# EAGLE design Car (EAGLE 7.3.0)
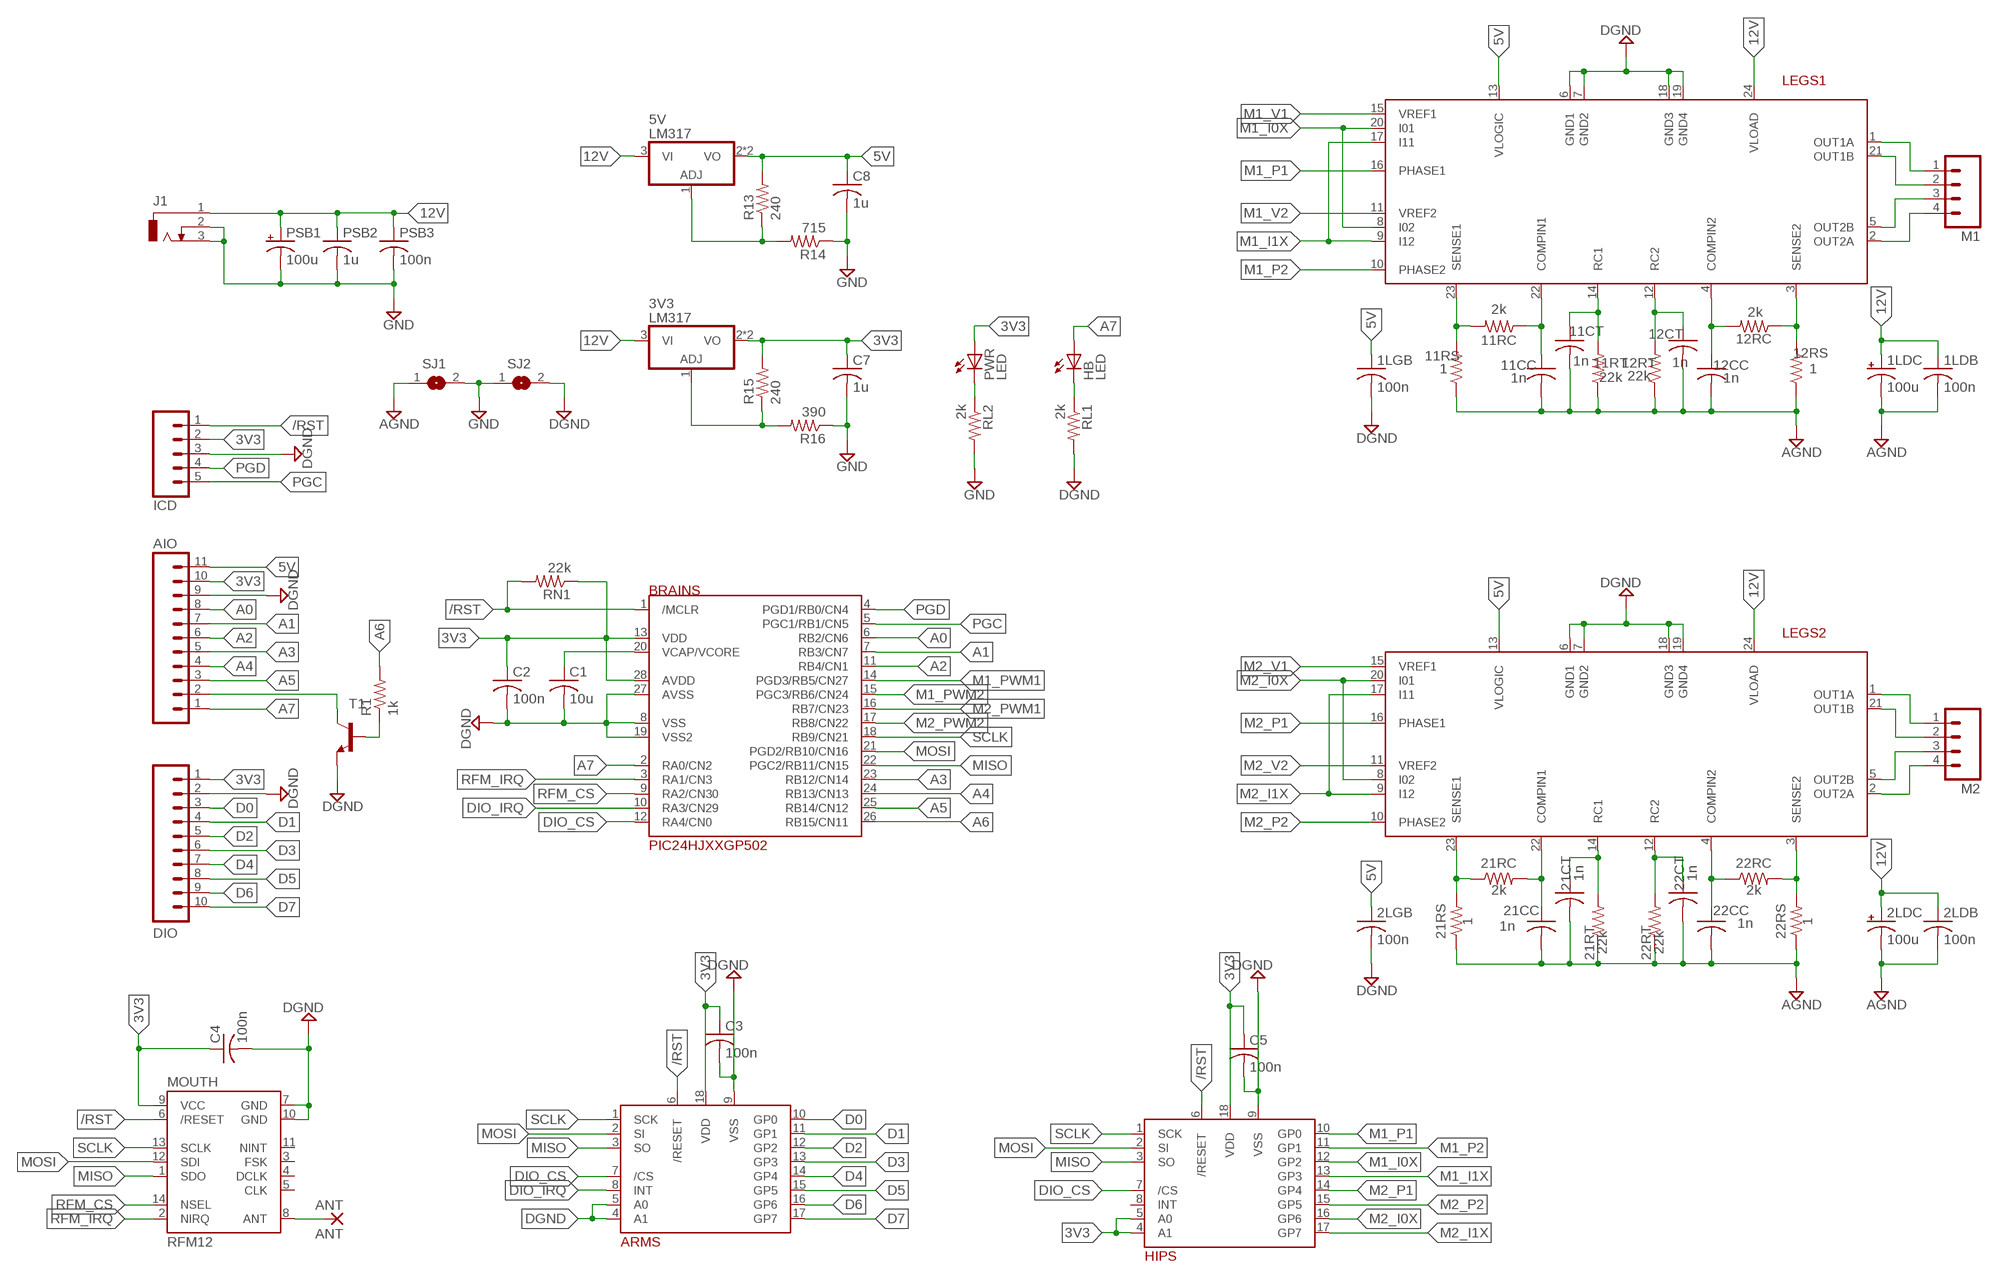
[diagram p0: schematic, sheet 1, part 1 of 2]
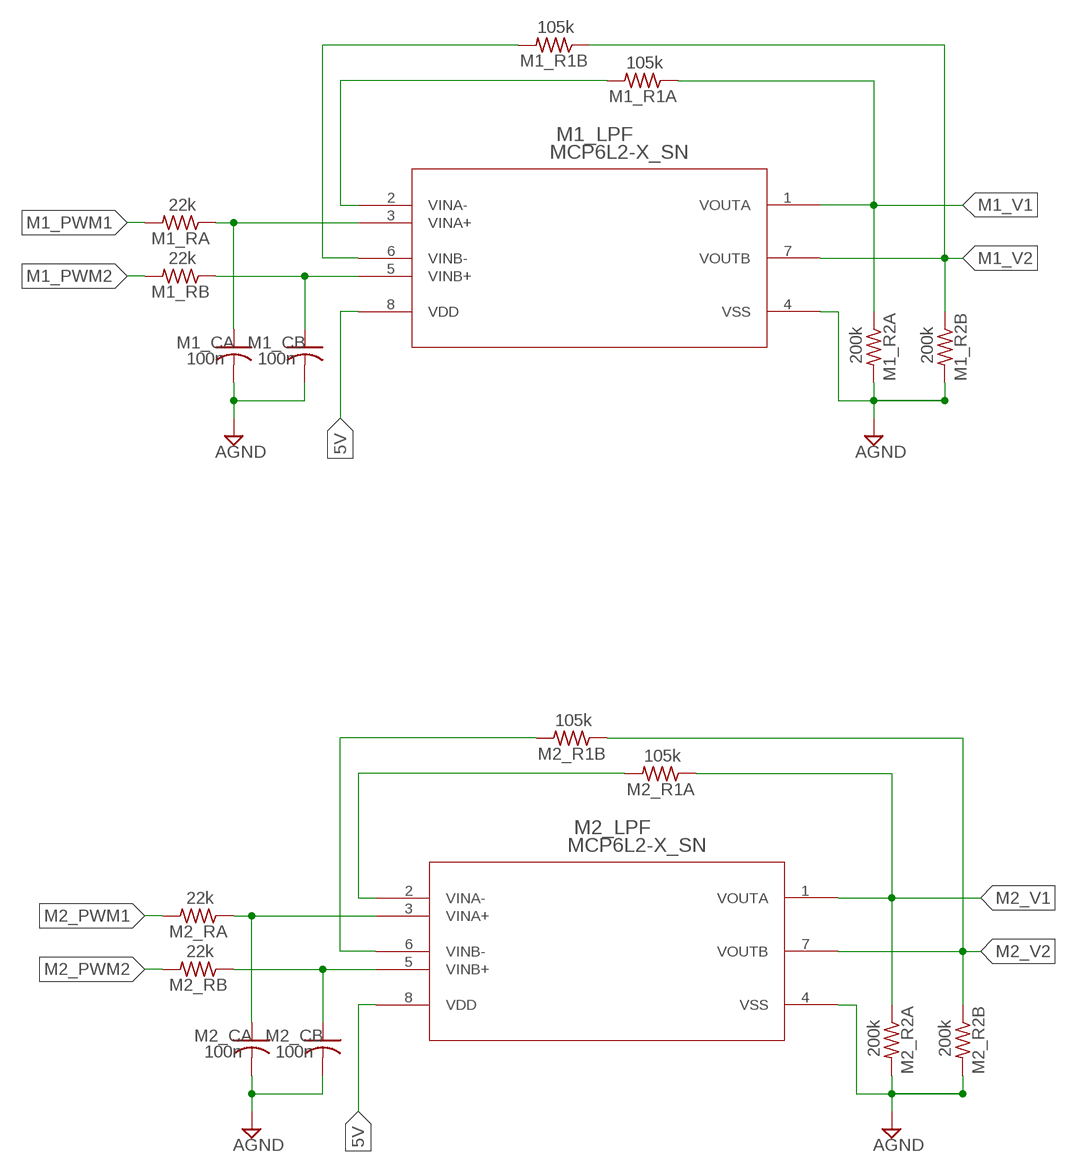
[diagram p1: schematic, sheet 1, part 2 of 2]

## Parts
1LDB  100n  C-USC0805  [C0805]
1LDC  100u  CAP_POLC  [PANASONIC_C]
1LGB  100n  C-USC0805  [C0805]
2LDB  100n  C-USC0805  [C0805]
2LDC  100u  CAP_POLC  [PANASONIC_C]
2LGB  100n  C-USC0805  [C0805]
3V3  LM317  [SOT23]
5V  LM317  [SOT23]
11CC  1n  C-USC0805  [C0805]
11CT  1n  C-USC0805  [C0805]
11RC  2k  R-US_R0805  [R0805]
11RS  1  R-US_R2512  [R2512]
11RT  22k  R-US_R0805  [R0805]
12CC  1n  C-USC0805  [C0805]
12CT  1n  C-USC0805  [C0805]
12RC  2k  R-US_R0805  [R0805]
12RS  1  R-US_R2512  [R2512]
12RT  22k  R-US_R0805  [R0805]
21CC  1n  C-USC0805  [C0805]
21CT  1n  C-USC0805  [C0805]
21RC  2k  R-US_R0805  [R0805]
21RS  1  R-US_R2512  [R2512]
21RT  22k  R-US_R0805  [R0805]
22CC  1n  C-USC0805  [C0805]
22CT  1n  C-USC0805  [C0805]
22RC  2k  R-US_R0805  [R0805]
22RS  1  R-US_R2512  [R2512]
22RT  22k  R-US_R0805  [R0805]
AIO  M11LOCK  [1X11_LOCK]
ANT  ANT  2,15/1,0  [2,15/1,0]
ARMS  MCP23S08  [SO-18W]
BRAINS  PIC24HJXXGP502  [SO28W]
C1  10u  C-USC1206  [C1206]
C2  100n  C-USC0805  [C0805]
C3  100n  C-USC0805  [C0805]
C4  100n  C-USC0805  [C0805]
C5  100n  C-USC0805  [C0805]
C7  1u  C-USC1206  [C1206]
C8  1u  C-USC1206  [C1206]
DIO  M10LOCK  [1X10_LOCK]
HB  LED  LEDCHIP-LED0805  [CHIP-LED0805]
HIPS  MCP23S08  [SO-18W]
ICD  M05LOCK  [1X05_LOCK]
J1  DCJ0303  [DCJ0303]
LEGS1  MTS62C19A  [SOP24L]
LEGS2  MTS62C19A  [SOP24L]
M1  M04LOCK_LONGPADS  [1X04_LOCK_LONGPADS]
M1_CA  100n  C-USC0805  [C0805]
M1_CB  100n  C-USC0805  [C0805]
M1_LPF  MCP6L2-X_SN  [SOIC8-N_MC]
M1_R1A  105k  R-US_R0805  [R0805]
M1_R1B  105k  R-US_R0805  [R0805]
M1_R2A  200k  R-US_R0805  [R0805]
M1_R2B  200k  R-US_R0805  [R0805]
M1_RA  22k  R-US_R0805  [R0805]
M1_RB  22k  R-US_R0805  [R0805]
M2  M04LOCK_LONGPADS  [1X04_LOCK_LONGPADS]
M2_CA  100n  C-USC0805  [C0805]
M2_CB  100n  C-USC0805  [C0805]
M2_LPF  MCP6L2-X_SN  [SOIC8-N_MC]
M2_R1A  105k  R-US_R0805  [R0805]
M2_R1B  105k  R-US_R0805  [R0805]
M2_R2A  200k  R-US_R0805  [R0805]
M2_R2B  200k  R-US_R0805  [R0805]
M2_RA  22k  R-US_R0805  [R0805]
M2_RB  22k  R-US_R0805  [R0805]
MOUTH  RFM12  [RFM12-XXX-S2]
PSB1  100u  CAP_POLC  [PANASONIC_C]
PSB2  1u  C-USC1206  [C1206]
PSB3  100n  C-USC0805  [C0805]
PWR  LED  LEDCHIP-LED0805  [CHIP-LED0805]
R1  1k  R-US_R0805  [R0805]
R13  240  R-US_R0805  [R0805]
R14  715  R-US_R0805  [R0805]
R15  240  R-US_R0805  [R0805]
R16  390  R-US_R0805  [R0805]
RL1  2k  R-US_R0805  [R0805]
RL2  2k  R-US_R0805  [R0805]
RN1  22k  R-US_R0805  [R0805]
SJ1  SJ  [SJ]
SJ2  SJ  [SJ]
T1  BC817-16-NPN-SOT23-BEC  [SOT23-BEC]

## Nets
3V3 [power]: 3V3.2(VO) 3V3.4(VO) AIO.10 ARMS.18(VDD) BRAINS.13(VDD) BRAINS.28(AVDD) C2.1 C3.1 C4.1 C5.1 C7.1 DIO.1 HIPS.4(A1) HIPS.5(A0) HIPS.18(VDD) ICD.2 MOUTH.9(VCC) PWR.A R15.2 RN1.1
5V [power]: 1LGB.1 2LGB.1 5V.2(VO) 5V.4(VO) AIO.11 C8.1 LEGS1.13(VLOGIC) LEGS2.13(VLOGIC) M1_LPF.8(VDD) M2_LPF.8(VDD) R13.2
12V [power]: 1LDB.1 1LDC.+ 2LDB.1 2LDC.+ 3V3.3(VI) 5V.3(VI) J1.1 LEGS1.24(VLOAD) LEGS2.24(VLOAD) PSB1.+ PSB2.1 PSB3.1
/RST: ARMS.6(/RESET) BRAINS.1(/MCLR) HIPS.6(/RESET) ICD.1 MOUTH.6(/RESET) RN1.2
A0: AIO.8 BRAINS.6(RB2/CN6)
A1: AIO.7 BRAINS.7(RB3/CN7)
A2: AIO.6 BRAINS.11(RB4/CN1)
A3: AIO.5 BRAINS.23(RB12/CN14)
A4: AIO.4 BRAINS.24(RB13/CN13)
A5: AIO.3 BRAINS.25(RB14/CN12)
A6: BRAINS.26(RB15/CN11) R1.2
A7: AIO.1 BRAINS.2(RA0/CN2) HB.A
AGND [power]: 1LDB.2 1LDC.- 2LDB.2 2LDC.- 11CC.2 11CT.2 11RS.1 11RT.1 12CC.2 12CT.2 12RS.1 12RT.1 21CC.2 21CT.2 21RS.1 21RT.1 22CC.2 22CT.2 22RS.1 22RT.1 M1_CA.2 M1_CB.2 M1_LPF.4(VSS) M1_R2A.2 M1_R2B.2 M2_CA.2 M2_CB.2 M2_LPF.4(VSS) M2_R2A.2 M2_R2B.2 SJ1.1
D0: ARMS.10(GP0) DIO.3
D1: ARMS.11(GP1) DIO.4
D2: ARMS.12(GP2) DIO.5
D3: ARMS.13(GP3) DIO.6
D4: ARMS.14(GP4) DIO.7
D5: ARMS.15(GP5) DIO.8
D6: ARMS.16(GP6) DIO.9
D7: ARMS.17(GP7) DIO.10
DGND [power]: 1LGB.2 2LGB.2 AIO.9 ARMS.4(A1) ARMS.5(A0) ARMS.9(VSS) BRAINS.8(VSS) BRAINS.19(VSS2) BRAINS.27(AVSS) C1.2 C2.2 C3.2 C4.2 C5.2 DIO.2 HIPS.9(VSS) ICD.3 LEGS1.6(GND1) LEGS1.7(GND2) LEGS1.18(GND3) LEGS1.19(GND4) LEGS2.6(GND1) LEGS2.7(GND2) LEGS2.18(GND3) LEGS2.19(GND4) MOUTH.7(GND) MOUTH.10(GND) RL1.2 SJ2.2 T1.E
DIO_CS: ARMS.7(/CS) BRAINS.12(RA4/CN0) HIPS.7(/CS)
DIO_IRQ: ARMS.8(INT) BRAINS.10(RA3/CN29)
GND [power]: C7.2 C8.2 J1.2 J1.3 PSB1.- PSB2.2 PSB3.2 R14.1 R16.1 RL2.2 SJ1.2 SJ2.1
M1_I0X [power]: HIPS.12(GP2) LEGS1.8(I02) LEGS1.20(I01)
M1_I1X [power]: HIPS.13(GP3) LEGS1.9(I12) LEGS1.17(I11)
M1_P1: HIPS.10(GP0) LEGS1.16(PHASE1)
M1_P2: HIPS.11(GP1) LEGS1.10(PHASE2)
M1_PWM1: BRAINS.14(PGD3/RB5/CN27) M1_RA.2
M1_PWM2: BRAINS.15(PGC3/RB6/CN24) M1_RB.2
M1_V1: LEGS1.15(VREF1) M1_LPF.1(VOUTA) M1_R1A.1 M1_R2A.1
M1_V2: LEGS1.11(VREF2) M1_LPF.7(VOUTB) M1_R1B.1 M1_R2B.1
M2_I0X [power]: HIPS.16(GP6) LEGS2.8(I02) LEGS2.20(I01)
M2_I1X [power]: HIPS.17(GP7) LEGS2.9(I12) LEGS2.17(I11)
M2_P1: HIPS.14(GP4) LEGS2.16(PHASE1)
M2_P2: HIPS.15(GP5) LEGS2.10(PHASE2)
M2_PWM1: BRAINS.16(RB7/CN23) M2_RA.2
M2_PWM2: BRAINS.17(RB8/CN22) M2_RB.2
M2_V1: LEGS2.15(VREF1) M2_LPF.1(VOUTA) M2_R1A.1 M2_R2A.1
M2_V2: LEGS2.11(VREF2) M2_LPF.7(VOUTB) M2_R1B.1 M2_R2B.1
MISO: ARMS.3(SO) BRAINS.22(PGC2/RB11/CN15) HIPS.3(SO) MOUTH.1(SDO)
MOSI: ARMS.2(SI) BRAINS.21(PGD2/RB10/CN16) HIPS.2(SI) MOUTH.12(SDI)
N$1 [power]: LEGS1.21(OUT1B) M1.2
N$2 [power]: LEGS1.1(OUT1A) M1.1
N$3: M1_CA.1 M1_LPF.3(VINA+) M1_RA.1
N$4 [power]: LEGS1.5(OUT2B) M1.3
N$5 [power]: LEGS1.2(OUT2A) M1.4
N$6 [power]: LEGS2.21(OUT1B) M2.2
N$7: M1_LPF.2(VINA-) M1_R1A.2
N$8 [power]: LEGS2.1(OUT1A) M2.1
N$9 [power]: LEGS2.5(OUT2B) M2.3
N$10 [power]: LEGS2.2(OUT2A) M2.4
N$11: ANT.1(P) MOUTH.8(ANT)
N$12: M2_CA.1 M2_LPF.3(VINA+) M2_RA.1
N$13 [power]: 21RC.1 21RS.2 LEGS2.23(SENSE1)
N$14: 21CC.1 21RC.2 LEGS2.22(COMPIN1)
N$15: 22CT.1 22RT.2 LEGS2.12(RC2)
N$16 [power]: 22RC.2 22RS.2 LEGS2.3(SENSE2)
N$17: 22CC.1 22RC.1 LEGS2.4(COMPIN2)
N$18: 21CT.1 21RT.2 LEGS2.14(RC1)
N$19: M2_LPF.2(VINA-) M2_R1A.2
N$20: 3V3.1(ADJ) R15.1 R16.2
N$21: M1_LPF.6(VINB-) M1_R1B.2
N$22: M1_CB.1 M1_LPF.5(VINB+) M1_RB.1
N$23: M2_LPF.6(VINB-) M2_R1B.2
N$24: M2_CB.1 M2_LPF.5(VINB+) M2_RB.1
N$26: AIO.2 T1.C
N$27: 5V.1(ADJ) R13.1 R14.2
N$28: R1.1 T1.B
N$31 [power]: 11RC.2 11RS.2 LEGS1.23(SENSE1)
N$33: 11CC.1 11RC.1 LEGS1.22(COMPIN1)
N$34: 12CC.1 12RC.2 LEGS1.4(COMPIN2)
N$35 [power]: 12RC.1 12RS.2 LEGS1.3(SENSE2)
N$40: BRAINS.20(VCAP/VCORE) C1.1
N$41: 11CT.1 11RT.2 LEGS1.14(RC1)
N$42: 12CT.1 12RT.2 LEGS1.12(RC2)
N$46: HB.C RL1.1
N$65: PWR.C RL2.1
PGC: BRAINS.5(PGC1/RB1/CN5) ICD.5
PGD: BRAINS.4(PGD1/RB0/CN4) ICD.4
RFM_CS: BRAINS.9(RA2/CN30) MOUTH.14(NSEL)
RFM_IRQ: BRAINS.3(RA1/CN3) MOUTH.2(NIRQ)
SCLK: ARMS.1(SCK) BRAINS.18(RB9/CN21) HIPS.1(SCK) MOUTH.13(SCLK)
Unconnected: HIPS.8(INT) MOUTH.3(FSK) MOUTH.4(DCLK) MOUTH.5(CLK) MOUTH.11(NINT)

## Library data of the parts
1LDB 1LGB 2LDB 2LGB 11CC 11CT 12CC 12CT 21CC 21CT 22CC 22CT C1-C5 C7 C8 M1_CA M1_CB M2_CA M2_CB PSB2 PSB3 = rcl:C-US: CAPACITOR, American symbol
1LDC 2LDC PSB1 = SparkFun-Passives:CAP_POL: Capacitor Polarized These are standard SMD and PTH capacitors. Normally 10uF, 47uF, and 100uF in electrolytic and tantalum varieties. Always verify the external diameter of the through hole cap, it varies with capacity, voltage, and manufacturer. The EIA devices should be standard.
3V3 5V = misc:LM317
11RC 11RT 12RC 12RT 21RC 21RT 22RC 22RT M1_R1A M1_R1B M1_R2A M1_R2B M1_RA M1_RB M2_R1A M2_R1B M2_R2A M2_R2B M2_RA M2_RB R1 R13-R16 RL1 RL2 RN1 = rcl:R-US_: RESISTOR, American symbol
11RS 12RS 21RS 22RS = resistor:R-US_: RESISTOR, American symbol
AIO = SparkFun-Connectors:M11: Header 11 Standard 11-pin 0.1" header. Use with straight break away headers (SKU : PRT-00116), right angle break away headers (PRT-00553), swiss pins (PRT-00743), machine pins (PRT-00117), and female headers (PRT-00115).
ANT = wirepad:2,15/1,0: THROUGH-HOLE PAD
ARMS HIPS = microchip:MCP23S08
BRAINS = microchip:PIC24HJXXGP502
DIO = SparkFun-Connectors:M10: Header 10 Standard 10-pin 0.1" header. Use with straight break away headers (SKU : PRT-00116), right angle break away headers (PRT-00553), swiss pins (PRT-00743), machine pins (PRT-00117), and female headers (PRT-00115).
HB PWR = led:LED: LED OSRAM: - CHIPLED LG R971, LG N971, LY N971, LG Q971, LY Q971, LO R971, LY R971 LH N974, LH R974 LS Q976, LO Q976, LY Q976 LO Q996 - Hyper CHIPLED LW Q18S LB Q993, LB Q99A, LB R99A - SideLED LS A670, LO A670, LY A670, LG A670, LP A670 LB A673, LV A673, LT A673, LW A673 LH A674 LY A675 LS A676, LA A676, LO A676, LY A676, LW A676 LS A679, LY A679, LG A679 - Hyper Micro SIDELED® LS Y876, LA Y876, LO Y876, LY Y876 LT Y87S - SmartLED LW L88C, LW L88S LB L89C, LB L89S, LG L890 LS L89K, LO L89K, LY L89K LS L896, LA L896, LO L896, LY L896 - TOPLED LS T670, LO T670, LY T670, LG T670, LP T670 LSG T670, LSP T670, LSY T670, LOP T670, LYG T670 LG T671, LOG T671, LSG T671 LB T673, LV T673, LT T673, LW T673 LH T674 LS T676, LA T676, LO T676, LY T676, LB T676, LH T676, LSB T676, LW T676 LB T67C, LV T67C, LT T67C, LS T67K, LO T67K, LY T67K, LW E67C LS E67B, LA E67B, LO E67B, LY E67B, LB E67C, LV E67C, LT E67C LW T67C LS T679, LY T679, LG T679 LS T770, LO T770, LY T770, LG T770, LP T770 LB T773, LV T773, LT T773, LW T773 LH T774 LS E675, LA E675, LY E675, LS T675 LS T776, LA T776, LO T776, LY T776, LB T776 LHGB T686 LT T68C, LB T68C - Hyper Mini TOPLED® LB M676 - Mini TOPLED Santana® LG M470 LS M47K, LO M47K, LY M47K Source: http://www.osram.convergy.de LUXEON: - LUMILED® LXK2-PW12-R00, LXK2-PW12-S00, LXK2-PW14-U00, LXK2-PW14-V00 LXK2-PM12-R00, LXK2-PM12-S00, LXK2-PM14-U00 LXK2-PE12-Q00, LXK2-PE12-R00, LXK2-PE12-S00, LXK2-PE14-T00, LXK2-PE14-U00 LXK2-PB12-K00, LXK2-PB12-L00, LXK2-PB12-M00, LXK2-PB14-N00, LXK2-PB14-P00, LXK2-PB14-Q00 LXK2-PR12-L00, LXK2-PR12-M00, LXK2-PR14-Q00, LXK2-PR14-R00 LXK2-PD12-Q00, LXK2-PD12-R00, LXK2-PD12-S00 LXK2-PH12-R00, LXK2-PH12-S00 LXK2-PL12-P00, LXK2-PL12-Q00, LXK2-PL12-R00 Source: www.luxeon.com KINGBRIGHT: KA-3528ASYC Source: www.kingbright.com
ICD = SparkFun-Connectors:M05: Header 5 Standard 5-pin 0.1" header. Use with straight break away headers (SKU : PRT-00116), right angle break away headers (PRT-00553), swiss pins (PRT-00743), machine pins (PRT-00117), and female headers (PRT-00115). Molex polarized connector foot print use with SKU : PRT-08230 with associated crimp pins and housings.
J1 = con-jack:DCJ0303: DC POWER JACK Source: DCJ0303.pdf; OC_FARNELL: unknown; OC_NEWARK: unknown
LEGS1 LEGS2 = microchip:MTS62C19A
M1 M2 = SparkFun-Connectors:M04: Header 4 Standard 4-pin 0.1" header. Use with straight break away headers (SKU : PRT-00116), right angle break away headers (PRT-00553), swiss pins (PRT-00743), machine pins (PRT-00117), and female headers (PRT-00115). Molex polarized connector foot print use with SKU : PRT-08231 with associated crimp pins and housings. 1MM SMD Version SKU: PRT-10208
M1_LPF M2_LPF = microchip2:MCP6L2-X_SN
MOUTH = SparkFun-RF:RFM12
SJ1 SJ2 = jumper:SJ: SMD solder JUMPER
T1 = transistor:*-NPN-: NPN Transistror BF959 corrected 2008.03.06

## Net classes
1 power: width 0.508 mm, clearance 0.254 mm

## Board
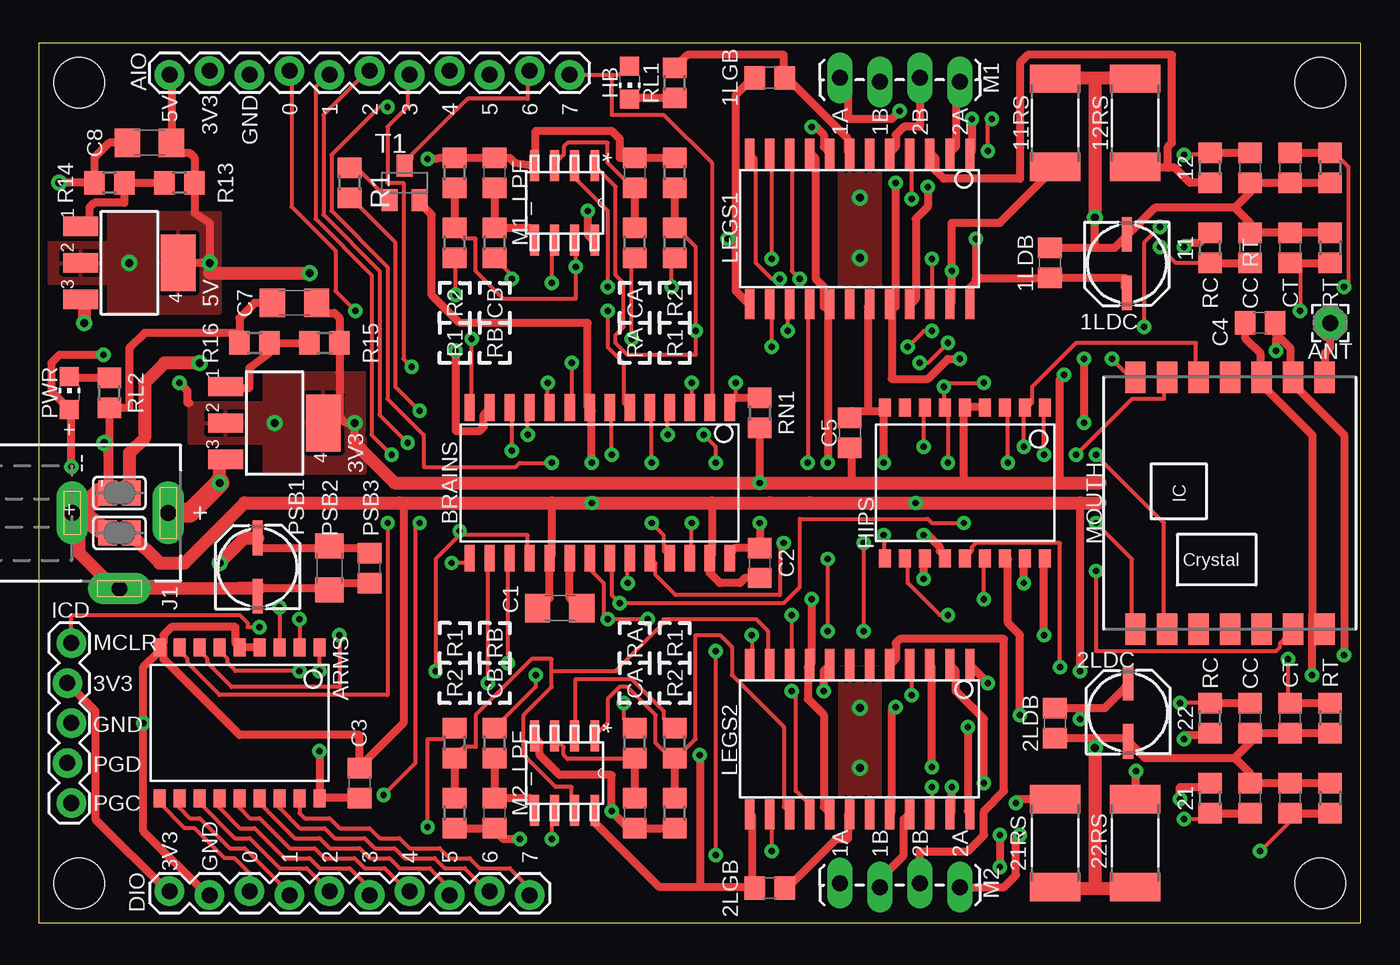
[diagram p2: board, top side]
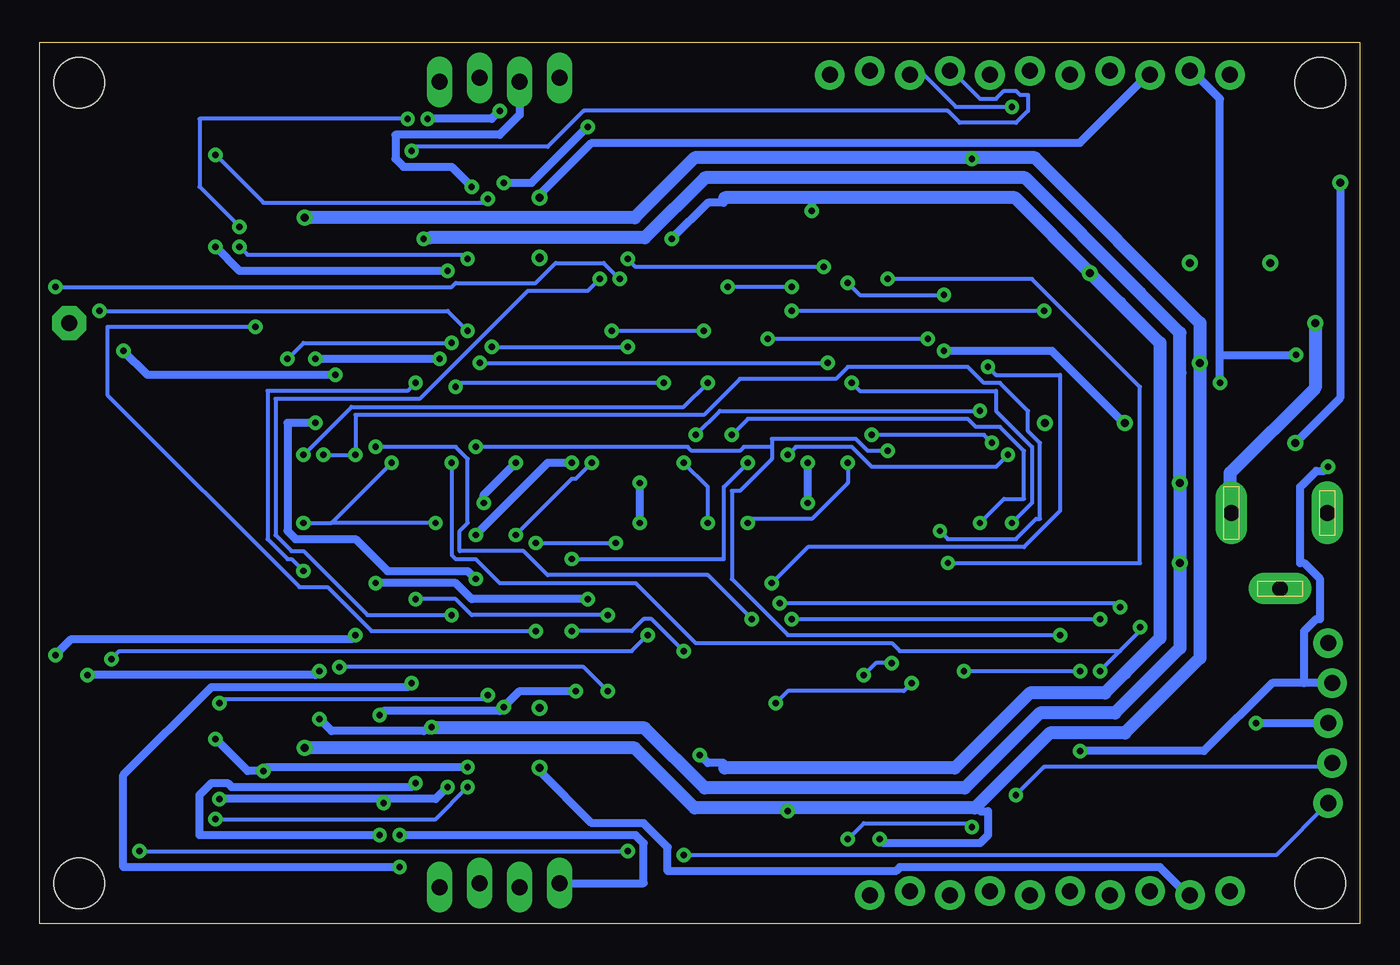
[diagram p3: board, bottom side, seen from below]

Size 83.82 x 55.88 mm. Coordinates in mm from the lower left corner, seen from the top.
Outline: 0,55.88 83.82,55.88 83.82,0 0,0 0,55.88
Copper layers (1*16): Top 0.035mm / dielectric 1.5mm / Bottom 0.035mm
Design rules "default *": minimum track width 10mil, minimum drill 16mil, track to track 10mil, track to pad 10mil, pad to pad 10mil, via to via 10mil, smd to smd 10mil, copper to edge 20mil, drill to drill 8mil, minimum pad ring 12mil, minimum via ring 10mil, stop-mask expansion 3mil, vias tented up to drill 25mil, thermal gap 10mil
Holes 3.2 mm at 2.54,53.34 2.54,2.54 81.28,53.34 81.28,2.54
tRestrict: area 0,0 to 4.4,4.4; area 79.4,0 to 83.8,4.4; area 0,51.4 to 4.4,55.9; area 79.4,51.4 to 83.8,55.9
bRestrict: area 0,51.4 to 4.4,55.9; area 79.4,51.4 to 83.8,55.9; area 79.4,0 to 83.8,4.4; area 0,0 to 4.4,4.4
vRestrict: area 67.6,18.7 to 83.6,34.7

### Footprints (pad centres in the part's own frame; a part is rotated, then mirrored left to right if it is on the bottom)
C0805 = smd 1.3 x 1.5: 1 -0.95,0; 2 0.95,0
PANASONIC_C = smd 2.2 x 0.65: + 1.9,-0.2; - -1.8,-0.2
SOT23 = smd 1.219 x 2.235: 1 -2.311,-3.099; 2 0,-3.099; 3 2.311,-3.099 | smd 3.6 x 2.2: 4 0,3.099
R0805 = smd 1.3 x 1.5: 1 -0.95,0; 2 0.95,0
R2512 = smd 1.8 x 3.2: 1 -2.8,0; 2 2.8,0
1X11_LOCK = drill 1.016 pad 1.88: 1 0,0.127; 2 2.54,-0.127; 3 5.08,0.127; 4 7.62,-0.127; 5 10.16,0.127; 6 12.7,-0.127; 7 15.24,0.127; 8 17.78,-0.127; 9 20.32,0.127; 10 22.86,-0.127; 11 25.4,0.127
2,15/1,0 = drill 1.016 pad 2.159 octagon: 1 0,0
SO-18W = smd 0.762 x 1.143: 1 -5.08,-4.788; 2 -3.81,-4.788; 3 -2.54,-4.788; 4 -1.27,-4.788; 5 0,-4.788; 6 1.27,-4.788; 7 2.54,-4.788; 8 3.81,-4.788; 9 5.08,-4.788; 10 5.08,4.788; 11 3.81,4.788; 12 2.54,4.788; 13 1.27,4.788; 14 0,4.788; 15 -1.27,4.788; 16 -2.54,4.788; 17 -3.81,4.788; 18 -5.08,4.788
SO28W = smd 0.65 x 1.7: 1 -7.62,-4.78; 2 -6.35,-4.78; 3 -5.08,-4.78; 4 -3.81,-4.78; 5 -2.54,-4.78; 6 -1.27,-4.78; 7 0,-4.78; 8 1.27,-4.78; 9 2.54,-4.78; 10 3.81,-4.78; 11 5.08,-4.78; 12 6.35,-4.78; 13 7.62,-4.78; 14 8.89,-4.78; 15 8.89,4.78; 16 7.62,4.78; 17 6.35,4.78; 18 5.08,4.78; 19 3.81,4.78; 20 2.54,4.78; 21 1.27,4.78; 22 0,4.78; 23 -1.27,4.78; 24 -2.54,4.78; 25 -3.81,4.78; 26 -5.08,4.78; 27 -6.35,4.78; 28 -7.62,4.78
C1206 = smd 1.6 x 1.8: 1 -1.4,0; 2 1.4,0
1X10_LOCK = drill 1.016 pad 1.88: 1 0,0.127; 2 2.54,-0.127; 3 5.08,0.127; 4 7.62,-0.127; 5 10.16,0.127; 6 12.7,-0.127; 7 15.24,0.127; 8 17.78,-0.127; 9 20.32,0.127; 10 22.86,-0.127
CHIP-LED0805 = smd 1.2 x 1.2: A 0,-1.05; C 0,1.05
1X05_LOCK = drill 1.016 pad 1.88: 1 0,0.127; 2 2.54,-0.127; 3 5.08,0.127; 4 7.62,-0.127; 5 10.16,0.127
DCJ0303 = drill 1 pad 2 long: 1 0,3.1; 2 4.8,0; 3 0,-3
SOP24L = smd 0.6 x 1.9: 1 -6.986,-4.717; 2 -5.716,-4.717; 3 -4.446,-4.717; 4 -3.176,-4.717; 5 -1.906,-4.717; 6 -0.636,-4.717; 7 0.634,-4.717; 8 1.904,-4.717; 9 3.174,-4.717; 10 4.444,-4.717; 11 5.714,-4.717; 12 6.984,-4.717; 13 6.984,4.843; 14 5.714,4.843; 15 4.444,4.843; 16 3.174,4.843; 17 1.904,4.843; 18 0.634,4.843; 19 -0.636,4.843; 20 -1.906,4.843; 21 -3.176,4.843; 22 -4.446,4.843; 23 -5.716,4.843; 24 -6.986,4.843
1X04_LOCK_LONGPADS = drill 1.016 long: 1 0,0; 2 2.54,-0.254; 3 5.08,0; 4 7.62,-0.254
SOIC8-N_MC = smd 1.981 x 0.559: 1 -2.362,1.905; 2 -2.362,0.635; 3 -2.362,-0.635; 4 -2.362,-1.905; 5 2.362,-1.905; 6 2.362,-0.635; 7 2.362,0.635; 8 2.362,1.905
RFM12-XXX-S2 = smd 2 x 1.3: 1 -8.01,6.01; 2 -8.01,4.01; 3 -8.01,2.01; 4 -8.01,0.01; 5 -8.01,-1.99; 6 -8.01,-3.99; 7 -8.01,-5.99; 8 7.99,-5.99; 9 7.99,-3.99; 10 7.99,-1.99; 11 7.99,0.01; 12 7.99,2.01; 13 7.99,4.01; 14 7.99,6.01
SJ = smd 1.168 x 1.6: 1 -0.762,0; 2 0.762,0
SOT23-BEC = smd 1 x 1.4: B -0.95,-1.1; C 0,1.1; E 0.95,-1.1

### Placement (x,y rotation side)
1LDB  64.14,41.91 90 top
1LDC  69.22,41.91 270 top
1LGB  46.35,53.66 0 top
2LDB  64.45,12.7 270 top
2LDC  68.9,13.34 90 top
2LGB  46.35,2.22 0 top
3V3  14.92,31.75 270 top
5V  5.71,41.91 270 top
11CC  76.83,42.86 90 top
11CT  79.38,42.86 90 top
11RC  74.3,42.86 90 top
11RS  64.45,50.8 270 top
11RT  81.92,42.86 270 top
12CC  76.83,47.94 270 top
12CT  79.38,47.94 270 top
12RC  74.3,47.94 90 top
12RS  69.53,50.8 270 top
12RT  81.92,47.94 90 top
21CC  76.83,7.94 90 top
21CT  79.38,7.94 90 top
21RC  74.3,7.94 270 top
21RS  64.45,5.08 90 top
21RT  81.92,7.94 270 top
22CC  76.83,13.02 270 top
22CT  79.38,13.02 270 top
22RC  74.3,13.02 270 top
22RS  69.53,5.08 90 top
22RT  81.92,13.02 90 top
AIO  33.66,53.98 180 top
ANT  81.92,38.1 0 top
ARMS  12.7,12.7 180 top
BRAINS  36.2,27.94 180 top
C1  33.02,20 180 top
C2  45.72,22.86 270 top
C3  20.32,8.89 90 top
C4  77.47,38.1 180 top
C5  51.44,31.11 90 top
C7  16.19,39.37 180 top
C8  6.99,49.53 180 top
DIO  8.26,1.91 0 top
HB  37.47,53.34 180 top
HIPS  58.74,27.94 180 top
ICD  1.91,17.78 270 top
J1  5.08,26.04 270 top
LEGS1  52.07,44.13 180 top
LEGS2  52.07,11.75 180 top
M1  50.8,53.66 0 top
M1_CA  37.78,47.62 90 top
M1_CB  28.89,47.62 90 top
M1_LPF  33.34,45.72 270 top
M1_R1A  40.32,43.18 270 top
M1_R1B  26.35,43.18 270 top
M1_R2A  40.32,47.62 90 top
M1_R2B  26.35,47.62 90 top
M1_RA  37.78,43.18 270 top
M1_RB  28.89,43.18 270 top
M2  50.8,2.54 0 top
M2_CA  37.78,6.99 270 top
M2_CB  28.89,6.99 270 top
M2_LPF  33.34,9.53 270 top
M2_R1A  40.32,11.43 90 top
M2_R1B  26.35,11.43 90 top
M2_R2A  40.32,6.99 270 top
M2_R2B  26.35,6.99 270 top
M2_RA  37.78,11.43 90 top
M2_RB  28.89,11.43 90 top
MOUTH  75.56,26.67 90 top
PSB1  13.65,22.54 90 top
PSB2  18.41,22.54 270 top
PSB3  20.95,22.54 270 top
PWR  1.91,33.66 0 top
R1  19.68,46.99 270 top
R13  8.89,46.99 0 top
R14  4.45,46.99 0 top
R15  18.1,36.83 0 top
R16  13.65,36.83 0 top
RL1  40.32,53.34 90 top
RL2  4.45,33.66 270 top
RN1  45.72,32.38 90 top
SJ1  5.08,27.3 180 top
SJ2  5.08,24.77 0 top
T1  23.18,46.99 0 top

### Tracks (layer width: path | path; a pad name or v marks a point on that pad's centre or on a via)
3V3  (via drill 0.41, 0.51)
  Top 0.508: R15.2 19.05,38.42 18.73,38.73 17.46,38.73 17.46,39.37 C7.1 | R15.2 19.05,34.92 19.05,32.14 | R15.2 | 78.64,37.24 78.42,37.47 C4.1 | 78.64,37.24 79.38,36.51 79.38,34.92 MOUTH.9 79.76,34.54 79.76,34.04 82.8,30.99 v82.8,17.02 | C3.1 17.78,7.94 ARMS.18 17.78,8.13 v17.78,10.92 | BRAINS.28 43.81,23.5 44.13,23.81 C2.1 45.72,23.88 v45.72,25.4 | 19.05,32.14 3V3.4 | 20,30.48 v20,31.75 19.44,31.75 19.05,32.14 | v2.03,28.96 2.03,32.51 PWR.A 1.78,32.77 0.76,33.78 0.76,35.56 1.27,36.07 v4.06,36.07 | ICD.2 3.56,13.46 3.56,6.6 8.13,2.03 DIO.1 | v63.75,18.29 63.75,23.11 HIPS.18 | HIPS.4 59.94,32.77 58.93,32.77 HIPS.5 58.67,32.51 58.67,28.19 58.67,27.94 | C5.1 51.56,29.97 51.56,28.19 51.56,27.94 | RN1.1 45.72,31.24 45.72,28.19 v45.72,27.94 | v26.42,36.32 26.42,31.24 27.94,31.24 28.19,31.5 28.19,32.26 28.45,32.51 BRAINS.13 | v8.89,34.29 9.4,33.78 9.4,33.02 9.53,33.02 | v78.49,36.32 78.49,37.08 78.64,37.24 | v65.02,34.8 64.77,34.54 64.77,28.19 64.77,27.94
  Top 0.813: 67.31,27.94 64.77,27.94 58.67,27.94 51.56,27.94 v45.72,27.94 22.54,27.94 20,30.48
  Bottom 0.508: v2.03,28.96 2.29,28.7 2.79,28.7 3.81,27.69 3.81,22.86 3.56,22.86 2.54,21.84 2.54,19.3 2.79,19.3 3.56,18.54 3.56,15.24 | ICD.2 3.56,15.24 | v17.78,10.92 9.91,10.92 5.59,15.24 3.56,15.24 | v63.75,18.29 64.01,18.03 81.79,18.03 v82.8,17.02 | v26.42,36.32 19.56,36.32 14.99,31.75 v14.92,31.75 | v45.72,27.94 v45.72,25.4 | v8.89,34.29 8.89,36.07 | 8.89,36.07 8.89,52.32 10.67,54.1 AIO.10 | v78.49,36.32 76.96,34.8 v65.02,34.8 | 8.89,36.07 v4.06,36.07
  pour Top: 20.64,28.57 14.29,28.57 14.29,30.48 9.53,30.48 9.53,33.02 14.29,33.02 14.29,34.92 20.64,34.92
5V  (via drill 0.41, 0.51)
  Top 0.508: R13.2 9.84,48.58 9.53,48.9 8.26,48.9 8.26,49.53 C8.1 | C8.1 | R13.2 9.84,45.09 10.79,44.45 10.79,41.27 v10.79,41.91 5V.4 | R13.2 | LEGS2.13 45.21,6.86 45.21,2.29 2LGB.1 44.96,2.29 41.91,2.29 | 41.91,2.29 39.37,2.29 35.31,6.35 35.31,7.11 M2_LPF.8 | 44.2,43.43 44.2,40.13 44.96,39.37 LEGS1.13 | 44.2,43.43 44.2,52.58 45.21,53.59 1LGB.1 | v34.8,45.21 34.8,43.69 35.05,43.43 M1_LPF.8 | C8.1 8.38,53.85 AIO.11 | v43.69,43.43 44.2,43.43 | v41.91,10.67 41.91,2.29
  Top 0.813: 10.79,41.27 v17.14,41.27
  Bottom 0.508: v34.8,45.21 34.8,45.72 34.8,46.04 | v43.69,43.43 41.4,45.72 40.39,45.72 40.32,46.04 | v41.91,10.67 41.4,10.16 40.39,10.16 40.32,9.84
  Bottom 0.813: 40.32,9.84 25.72,9.84 20.95,14.61 16.19,14.61 14.92,15.88 12.7,18.1 12.7,26.04 12.7,34.29 12.7,36.83 15.24,39.37 v17.14,41.27 21.91,46.04 34.8,46.04 40.32,46.04
  other vias: 5.71,41.91
  pour Top: 11.43,38.73 4.45,38.73 4.45,40.64 0.64,40.64 0.64,43.18 4.45,43.18 4.45,45.09 11.43,45.09
12V  (via drill 0.41, 0.51)
  Top 0.508: 18.41,23.81 13.97,23.81 PSB1.+ | 18.41,23.81 20.95,23.81 PSB3.1 | 18.41,23.81 PSB2.1 | 1LDB.1 68.9,40.96 68.9,40.32 1LDC.+ | 1LDB.1 59.69,40.96 59.53,40.8 | 59.53,40.8 59.05,40.32 59.05,39.37 LEGS1.24 | 1LDB.1 | 66.04,13.65 2LDB.1 | 66.04,13.65 67.63,13.65 68.9,14.92 2LDC.+ | v58.93,12.45 58.93,7.11 LEGS2.24 | v66.04,12.95 66.04,13.46 66.04,13.65 | v59.44,43.43 59.44,40.89 59.53,40.8
  Top 0.813: 12.38,29.53 3V3.3 11.51,29.53 11.43,29.53 v11.43,27.94 | v2.86,38.1 2.86,39.37 2.54,39.69 5V.3 | v11.43,22.86 13.02,24.45 PSB1.+
  Top 1.27: v11.43,27.94 9.53,26.04 J1.1
  Bottom 0.508: v58.93,12.45 58.93,12.38 | J1.1 8.38,26.16 8.26,26.16 | v66.04,12.95 65.28,12.19 59.44,12.19 59.05,12.38 | v59.44,43.43 59.05,43.5
  Bottom 0.813: v2.86,38.1 2.86,33.97 8.26,28.57 8.26,26.16 8.26,26.04 | 59.05,12.38 58.93,12.38 45.4,12.38 41.59,8.57 25.08,8.57 20.32,13.34 15.56,13.34 11.43,17.46 v11.43,22.86 v11.43,27.94 11.43,34.92 11.43,37.47 13.97,40.01 21.27,47.31 41.59,47.31 45.4,43.5 59.05,43.5
/RST  (via drill 0.41)
  Top 0.254: v16.51,16 12.45,16 11.94,16.51 11.94,16.76 11.43,17.27 ARMS.6 | v13.97,18.8 13.21,18.8 13.21,19.05 12.7,19.56 2.03,19.56 ICD.1 | v44.2,34.29 44.2,33.53 44.13,33.34 | v67.06,22.35 67.06,17.27 78.49,17.27 78.74,17.53 78.74,17.78 79.5,18.54 MOUTH.6 | v59.94,34.29 57.4,34.29 v57.4,34.04 57.4,32.77 HIPS.6 57.66,32.51 v57.66,29.21
  Top 0.508: BRAINS.1 43.81,33.02 44.13,33.34 RN1.2
  Bottom 0.254: 15.24,17.27 13.97,18.54 v13.97,18.8 | 15.24,17.27 v16.51,16 | v57.4,34.04 57.15,34.29 v44.2,34.29 | v67.06,22.35 67.82,23.11 68.07,23.11 69.34,24.38 69.34,33.78 60.45,33.78 v59.94,34.29 | 15.24,17.27 29.21,17.27 29.72,17.78 42.16,17.78 45.97,21.59 54.61,21.59 56.13,23.11 57.4,23.11 57.66,23.37 v57.66,29.21
A0  (via drill 0.41)
  Top 0.254: v36.07,38.86 36.07,36.58 37.08,35.56 37.08,33.02 37.34,32.77 BRAINS.6 | v20.07,38.86 18.8,40.13 18.8,42.67 16,45.47 16,54.1 AIO.8
  Bottom 0.254: v20.07,38.86 v36.07,38.86
A1  (via drill 0.41)
  Top 0.254: v36.32,29.72 36.32,32.51 BRAINS.7 | v22.35,29.72 21.08,30.99 21.08,41.15 17.53,44.7 17.53,53.09 18.29,53.85 AIO.7
  Bottom 0.254: v36.32,29.72 35.81,30.23 32.26,30.23 30.99,28.96 23.11,28.96 v22.35,29.72
A2  (via drill 0.41)
  Top 0.254: v30.99,30.99 30.99,32.51 BRAINS.11 | v23.37,30.48 21.59,32.26 21.59,41.4 18.03,44.96 18.03,51.31 20.83,54.1 AIO.6
  Bottom 0.254: v30.99,30.99 23.88,30.99 v23.37,30.48
A3  (via drill 0.41)
  Top 0.254: v37.34,21.59 37.34,23.11 BRAINS.23 | v23.62,35.31 23.11,35.81 23.11,46.99 22.1,46.99 22.1,50.55 23.37,51.82 23.37,53.85 AIO.5
  Bottom 0.254: v37.34,21.59 35.05,23.88 21.34,23.88 19.05,26.16 19.05,34.8 23.11,34.8 v23.62,35.31
A4  (via drill 0.41)
  Top 0.254: v47.24,24.13 46.99,23.88 46.99,20.83 40.39,20.83 39.12,22.1 39.12,22.86 38.86,23.11 BRAINS.24 | v52.32,18.54 v52.32,24.13 | v70.1,37.85 70.1,43.18 v71.12,44.2 | v60.45,51.05 60.2,50.8 v60.2,49.02
  Bottom 0.254: v52.32,24.13 v47.24,24.13 | v52.32,18.54 62.74,18.54 65.53,21.34 67.31,21.34 79.5,33.53 79.5,37.85 v70.1,37.85 | v71.12,44.2 73.66,46.74 73.66,51.05 v60.45,51.05 | v60.2,49.02 59.94,49.28 51.56,49.28 49.28,51.56 26.16,51.56 25.4,50.8 21.84,50.8 21.08,51.56 21.08,52.58 21.59,52.58 21.84,52.83 22.61,52.83 23.11,52.32 24.13,52.32 25.91,54.1 AIO.4
A5  (via drill 0.41)
  Top 0.254: v38.86,25.4 39.62,24.64 39.62,23.62 39.88,23.37 BRAINS.25 | v32.51,29.21 30.48,29.21 30.23,28.96 24.38,28.96 24.38,30.99 22.1,33.27 22.1,41.66 18.54,45.21 18.54,48.77 21.59,51.82 v22.1,51.82
  Bottom 0.254: v38.86,25.4 38.61,25.65 34.8,25.65 32.51,27.94 v32.51,29.21 | v22.1,51.82 25.65,51.82 27.69,53.85 28.45,53.85 AIO.3
A6  (via drill 0.41)
  Top 0.254: v24.13,32.51 22.61,34.04 22.61,43.18 19.81,45.97 R1.2 | v42.16,30.99 42.93,30.23 v42.93,29.21 | v41.4,25.4 41.4,23.37 BRAINS.26
  Bottom 0.254: v24.13,32.51 40.64,32.51 v42.16,30.99 | v42.93,29.21 41.4,27.69 v41.4,25.4
A7
  Top 0.254: 36.32,53.85 33.78,53.85 AIO.1 | 36.32,53.85 36.83,53.85 37.34,54.36 HB.A | 36.32,53.85 36.32,51.31 39.62,51.31 42.67,48.26 42.67,32.77 BRAINS.2
AGND  (via drill 0.41, 0.51)
  Top 0.508: 36.83,48.58 38.42,48.58 M1_R2A.2 | 36.83,48.58 M1_CA.2 | M2_R2A.2 39.69,6.03 38.42,6.03 M2_CA.2 37.59,5.84 v36.32,7.11 36.32,9.4 33.02,9.4 31.75,10.67 31.75,11.43 31.5,11.68 M2_LPF.4 | M2_R2B.2 28.57,6.03 M2_CB.2 28.96,5.84 29.46,5.33 v30.48,5.33 | 25.4,48.58 27.94,48.58 | 25.4,48.58 M1_R2B.2 | 27.94,48.58 29.84,48.58 30.16,48.26 M1_LPF.4 31.5,48.26 31.5,50.29 36.32,50.29 36.83,49.78 36.83,48.77 36.83,48.58 | 27.94,48.58 M1_CB.2 | 66.99,42.86 68.26,42.86 68.9,43.5 1LDC.- 69.22,43.81 70.8,45.4 75.88,45.4 | 1LDB.2 66.99,42.86 | 66.99,11.75 2LDB.2 | 66.99,11.75 68.9,11.75 2LDC.- 69.22,11.43 70.17,10.48 75.88,10.48 | v66.99,11.11 66.99,11.75 | 76.83,11.75 77.15,12.06 | 77.15,12.06 22CT.2 | 77.15,12.06 22CC.2 76.83,11.43 75.88,10.48 | 22CT.2 22RT.1 | 22CT.2 | 21CT.2 21CC.2 | 21CT.2 21RT.1 | 21CT.2 | 75.88,10.48 76.83,9.53 21CC.2 | 76.83,8.57 21CC.2 | 12CT.2 12CC.2 76.83,47.31 76.83,46.35 75.88,45.4 | 12CT.2 12RT.1 | 12CT.2 | 11CT.2 11RT.1 | 11CT.2 11CC.2 76.83,44.45 75.88,45.4 | 11CT.2 | 66.99,42.86 v66.99,44.77 | v24.64,48.51 25.15,48.51 25.4,48.58
  Top 0.813: 66.99,53.66 64.45,53.66 11RS.1 64.14,53.66 | 66.99,53.66 69.53,53.66 12RS.1 | 66.99,53.66 v66.99,44.77 | 66.99,2.22 64.45,2.22 21RS.1 | 66.99,2.22 69.53,2.22 22RS.1 | v66.99,11.11 66.99,2.22 | v10.16,35.56 7.94,35.56 6.67,34.29 6.67,30.8 5.71,29.84 5.71,27.3 SJ1.1
  Top 1.27: 4.45,27.3 5.71,27.3
  Bottom 0.508: v30.48,5.33 30.23,5.08 24.13,5.08 23.62,5.59 23.62,7.11 24.13,7.11 24.38,7.37 | v24.64,48.51 24.64,48.58 | v36.32,7.11 36.32,7.3
  Bottom 0.813: v66.99,44.77 46.04,44.77 42.23,48.58 24.64,48.58 20.64,48.58 10.16,38.1 v10.16,35.56 10.16,16.83 14.92,12.06 19.68,12.06 24.38,7.37 24.45,7.3 36.32,7.3 42.23,7.3 46.04,11.11 v66.99,11.11
D0
  Top 0.254: ARMS.10 7.62,7.62 9.21,6.03 9.84,6.03 11.75,4.13 12.38,4.13 13.34,3.17 DIO.3
D1
  Top 0.254: ARMS.11 8.89,7.3 9.53,6.67 10.16,6.67 12.06,4.76 13.02,4.76 15.24,2.54 15.24,2.41 DIO.4
D2
  Top 0.254: ARMS.12 10.16,7.62 12.38,5.4 13.34,5.4 15.24,3.49 16.95,3.49 DIO.5
D3
  Top 0.254: ARMS.13 11.43,7.3 12.7,6.03 13.65,6.03 15.56,4.13 17.14,4.13 17.78,3.49 19.68,3.49 20.95,2.22 DIO.6
D4
  Top 0.254: ARMS.14 12.7,7.3 13.34,6.67 13.97,6.67 15.88,4.76 17.46,4.76 18.1,4.13 20,4.13 20.64,3.49 21.91,3.49 22.86,2.54 22.99,2.54 DIO.7
D5
  Top 0.254: ARMS.15 13.97,7.62 14.29,7.3 14.61,6.99 16.19,5.4 17.78,5.4 18.41,4.76 20.32,4.76 20.95,4.13 22.23,4.13 22.86,3.49 24.77,3.49 26.04,2.22 DIO.8
D6
  Top 0.254: ARMS.16 15.24,7.3 16.51,6.03 18.1,6.03 18.73,5.4 20.64,5.4 21.27,4.76 22.54,4.76 23.18,4.13 25.08,4.13 25.72,3.49 26.99,3.49 27.94,2.54 28.07,2.54 DIO.9
D7
  Top 0.254: ARMS.17 16.51,6.99 16.83,6.67 18.41,6.67 19.05,6.03 20.95,6.03 21.59,5.4 22.86,5.4 23.5,4.76 25.4,4.76 26.04,4.13 27.3,4.13 27.94,3.49 29.84,3.49 31.11,2.22 DIO.10
DGND  (via drill 0.41, 0.51)
  Top 0.508: C4.2 76.52,37.15 77.47,36.2 77.47,34.92 MOUTH.10 77.72,34.54 77.72,34.04 80.77,30.99 80.77,19.56 80.9,19.43 | C1.2 31.75,20 32.38,20.64 32.38,22.86 BRAINS.19 32.51,23.37 32.51,26.42 32.51,26.67 | C2.2 44.77,21.91 44.45,21.59 43.18,21.59 42.55,22.23 42.55,22.86 BRAINS.27 42.67,23.37 42.67,26.42 42.67,26.67 | 2LGB.2 47.5,2.29 50.55,5.33 51.31,5.33 51.31,6.86 LEGS2.18 | 12.7,17.53 12.45,17.78 12.45,18.8 8.38,18.8 7.87,18.29 7.87,17.78 7.62,17.53 ARMS.9 | 12.7,17.53 ARMS.5 12.7,17.53 | 12.7,17.53 13.97,17.53 ARMS.4 | ARMS.9 7.62,17.27 6.6,16.26 v6.6,12.7 6.6,5.84 10.67,1.78 DIO.2 | 52.58,32.51 51.56,32.51 51.56,32.26 C5.2 | 52.58,32.51 53.59,32.51 HIPS.9 53.59,32.26 v53.59,29.21 | LEGS1.7 51.31,49.02 51.31,49.78 47.5,53.59 1LGB.2 47.24,53.85 47.24,55.12 41.15,55.12 40.39,54.36 RL1.2 | 52.58,32.51 52.58,39.12 LEGS1.19 | T1.E 24.13,45.72 24.89,44.96 24.89,39.88 26.67,38.1 34.8,38.1 34.8,32.77 BRAINS.8 35.05,32.51 v35.05,29.21 | 80.9,19.43 81.53,18.8 MOUTH.7 | 22.86,26.67 23.11,26.42 23.11,12.7 20.32,9.91 C3.2 20.32,10.16 20.32,11.94 12.7,11.94 7.87,16.76 7.87,17.53 ARMS.9 | v80.77,15.75 80.77,19.3 80.9,19.43 | v66.04,16 66.04,26.42 66.04,26.67
  Top 0.61: SJ2.2 5.84,24.64
  Top 0.813: 5.84,24.64 7.62,22.86 9.21,22.86 13.02,26.67 22.86,26.67 32.51,26.67 v35.05,26.67 42.67,26.67 46.35,26.67 48.9,26.67 v55.63,26.67 66.04,26.67 67.31,26.67
  Bottom 0.508: v6.6,12.7 ICD.3 | v52.07,9.84 52.07,9.65 48.77,6.35 45.47,6.35 43.94,4.83 43.94,3.3 29.46,3.3 29.21,3.56 12.7,3.56 10.92,1.78 DIO.2 | AIO.9 13.46,53.85 17.78,49.53 48.77,49.53 52.07,46.23 v52.07,46.04 | v80.77,15.75 66.29,15.75 v66.04,16 | v35.05,26.67 v35.05,29.21 | v53.59,29.21 55.63,27.18 v55.63,26.67
  other vias: 52.07,13.65 52.07,42.23
  pour Top: 50.8,39.69 50.8,48.58 53.34,48.58 53.34,39.69
  pour Top: 50.8,16.19 50.8,7.3 53.34,7.3 53.34,16.19
DIO_CS  (via drill 0.41)
  Top 0.254: v19.05,18.29 19.05,14.99 12.19,14.99 10.67,16.51 10.67,16.76 10.16,17.27 ARMS.7 | v29.97,29.97 29.97,32.51 BRAINS.12 | v56.13,30.23 56.13,32.51 HIPS.7
  Bottom 0.254: v19.05,18.29 36.32,18.29 39.88,21.84 39.88,27.43 39.37,27.43 37.34,29.46 37.34,30.23 | 37.34,30.23 37.34,30.73 32,30.73 31.24,29.97 v29.97,29.97 | v56.13,30.23 42.67,30.23 42.42,29.97 39.37,29.97 39.12,30.23 37.34,30.23
DIO_IRQ  (via drill 0.41)
  Top 0.254: v22.1,25.4 22.1,14.48 11.43,14.48 9.4,16.51 9.4,16.76 8.89,17.27 ARMS.8 | v32.26,34.29 32.26,32.77 BRAINS.10
  Bottom 0.254: v22.1,25.4 20.83,26.67 20.83,30.23 23.11,32.51 23.11,33.78 31.75,33.78 v32.26,34.29
GND  (via drill 0.51)
  Top 0.508: C8.2 4.45,49.53 3.49,48.58 R14.1 v1.27,46.99 | 12.7,37.47 12.7,38.42 13.65,39.37 C7.2 | 18.41,21.27 13.97,21.27 PSB1.- | PSB3.2 18.41,21.59 18.41,21.27 | 18.41,21.27 PSB2.2 | 12.7,37.47 6.67,37.47 5.71,36.51 5.71,32.7 RL2.2 4.13,32.7 4.45,32.38 4.45,27.62 SJ1.2 4.32,29.84 v4.13,30.48 | 12.7,37.47 R16.1
  Top 0.813: 3.81,27.3 SJ1.2 | 2.54,26.04 J1.3 2.54,25.4 2.54,23.5 4.45,21.59 J1.2 12.7,21.27 13.97,21.27
  Top 1.27: 3.81,27.3 2.54,26.04 SJ2.1
  Bottom 0.508: v1.27,46.99 1.27,33.34 v4.13,30.48
M1_I0X  (via drill 0.41)
  Top 0.508: v56.13,21.84 56.13,23.11 HIPS.12 | v66.29,35.81 v66.29,31.75 | v58.42,35.81 57.66,35.81 56.39,34.54 54.1,34.54 54.1,39.12 | 54.1,39.12 LEGS1.20 | v49.02,50.55 49.28,50.55 49.78,50.04 49.78,49.28 50.04,49.02 LEGS1.8 | v54.36,46.99 54.36,39.12 54.1,39.12
  Bottom 0.508: v56.13,21.84 56.64,22.35 61.72,22.35 63.75,24.38 67.56,24.38 68.07,24.89 68.07,31.75 v66.29,31.75 | v58.42,35.81 v66.29,35.81 | v49.02,50.55 52.58,46.99 v54.36,46.99
M1_I1X  (via drill 0.41)
  Top 0.508: v56.13,24.64 56.39,24.64 57.15,23.88 57.15,23.62 57.4,23.37 HIPS.13 | 50.04,39.12 v50.04,29.21 | 50.04,39.12 LEGS1.17 | LEGS1.9 49.02,48.77 49.28,48.51 49.28,40.89 49.78,40.39 49.78,39.12 50.04,39.12
  Bottom 0.508: v56.13,24.64 51.56,29.21 v50.04,29.21
M1_P1  (via drill 0.41)
  Top 0.254: v53.59,24.64 53.59,23.37 HIPS.10 | v48.77,29.21 48.77,39.12 LEGS1.16
  Bottom 0.254: v53.59,24.64 50.04,28.19 49.78,28.19 v48.77,29.21
M1_P2  (via drill 0.41)
  Top 0.254: v57.66,19.56 57.15,19.56 55.12,21.59 55.12,23.11 HIPS.11 | v48.26,40.89 47.75,41.4 47.75,48.77 LEGS1.10
  Bottom 0.254: v57.66,19.56 62.99,19.56 67.06,23.62 67.82,23.62 68.83,24.64 68.83,33.27 59.69,33.27 52.83,40.13 49.02,40.13 v48.26,40.89
M1_PWM1  (via drill 0.41)
  Top 0.254: v37.59,37.08 37.59,42.16 M1_RA.2 | v27.43,37.08 27.43,32.77 BRAINS.14
  Bottom 0.254: v27.43,37.08 v37.59,37.08
M1_PWM2  (via drill 0.41)
  Top 0.254: v29.97,40.89 29.97,41.15 28.96,42.16 M1_RB.2 | v26.16,22.86 27.18,22.86 27.18,23.11 BRAINS.15
  Bottom 0.254: v29.97,40.89 20.83,40.89 13.97,34.04 13.97,22.86 v26.16,22.86
M1_V1  (via drill 0.41)
  Top 0.254: v47.5,37.59 47.5,39.12 LEGS1.15 | M1_R1A.1 40.39,44.2 41.66,42.93 v41.66,37.59 41.66,36.07 37.34,36.07 36.58,36.83 36.58,37.34 37.08,37.85 37.08,40.64 36.58,41.15 36.58,46.74 35.31,48.01 M1_LPF.1
  Top 0.508: M1_R1A.1 M1_R2A.1
  Bottom 0.254: v41.66,37.59 v47.5,37.59
M1_V2  (via drill 0.41)
  Top 0.254: v46.48,42.16 46.48,48.77 LEGS1.11 | M1_LPF.7 34.04,43.18 v34.04,41.66 34.04,39.62 29.46,39.62 27.69,41.4 27.69,43.43 26.92,43.43 26.42,43.94 M1_R1B.1
  Top 0.508: M1_R1B.1 M1_R2B.1
  Bottom 0.254: v46.48,42.16 45.97,41.66 v34.04,41.66
M2_I0X  (via drill 0.41)
  Top 0.508: v62.23,13.21 62.23,18.29 61.47,19.05 61.47,23.11 HIPS.16 | v54.36,13.72 54.1,13.46 54.1,7.11 LEGS2.20 | v49.78,14.73 49.78,16 50.04,16.26 LEGS2.8
  Bottom 0.508: v62.23,13.21 61.98,13.46 54.61,13.46 v54.36,13.72 53.34,14.73 v49.78,14.73
M2_I1X  (via drill 0.41)
  Top 0.508: v62.48,21.59 62.48,23.11 HIPS.17 | v49.02,20.57 49.02,16.51 LEGS2.9 48.77,16.26 48.77,14.22 49.78,13.21 49.78,7.37 50.04,7.11 LEGS2.17
  Bottom 0.508: v62.48,21.59 57.4,21.59 56.39,20.57 v49.02,20.57
M2_P1  (via drill 0.41)
  Top 0.254: v64.77,16.26 64.77,24.13 59.44,24.13 59.18,23.88 59.18,23.62 58.93,23.37 HIPS.14 | v47.75,14.73 48.01,14.48 48.01,8.38 48.77,7.62 48.77,7.11 LEGS2.16
  Bottom 0.254: v64.77,16.26 49.28,16.26 v47.75,14.73
M2_P2  (via drill 0.41)
  Top 0.254: v59.94,20.57 59.94,23.11 HIPS.15 | v47.75,19.56 47.75,16.51 LEGS2.10
  Bottom 0.254: v59.94,20.57 57.4,20.57 56.39,19.56 v47.75,19.56
M2_PWM1  (via drill 0.41)
  Top 0.254: v37.08,13.97 37.08,12.95 37.59,12.45 M2_RA.2 | v28.45,15.24 28.45,23.11 BRAINS.16
  Bottom 0.254: v37.08,13.97 36.32,14.73 28.96,14.73 v28.45,15.24
M2_PWM2  (via drill 0.41)
  Top 0.254: v31.5,15.75 31.5,14.99 28.96,12.45 M2_RB.2 | v29.72,16.51 29.72,23.11 BRAINS.17
  Bottom 0.254: v31.5,15.75 30.73,16.51 v29.72,16.51
M2_V1
  Top 0.254: LEGS2.15 47.5,7.11 47.24,7.37 47.24,12.45 43.94,15.75 43.94,17.53 43.18,18.29 41.66,18.29 41.66,11.68 40.39,10.41 M2_R1A.1 40.13,10.41 39.12,11.43 39.12,13.21 37.34,14.99 36.83,14.99 36.07,14.22 36.07,12.7 35.31,11.94 M2_LPF.1
  Top 0.508: M2_R2A.1 M2_R1A.1
M2_V2
  Top 0.254: 32.51,16 36.58,16 39.62,19.05 39.62,19.3 45.47,19.3 46.23,18.54 46.23,16.51 LEGS2.11 | 32.51,16 32.51,14.99 30.73,13.21 30.73,10.67 32.77,8.64 33.78,8.64 33.78,7.37 M2_LPF.7 | 32.51,16 32.51,16.76 31.24,16.76 27.69,13.21 27.69,11.18 26.92,11.18 26.42,10.67 M2_R1B.1
  Top 0.508: M2_R2B.1 M2_R1B.1
MISO  (via drill 0.41)
  Top 0.254: v61.47,29.21 61.47,32.51 HIPS.3 | v67.06,25.4 69.34,23.11 69.34,18.8 MOUTH.1 | v15.24,20.07 15.24,17.53 ARMS.3 | BRAINS.22 36.32,23.11 36.32,20.83 v36.83,20.32 47.24,20.32 48.26,21.34 48.26,25.65 56.39,25.65 56.64,25.4 v58.67,25.4
  Bottom 0.254: 65.28,25.4 v61.47,29.21 | v67.06,25.4 65.28,25.4 | v15.24,20.07 15.49,20.32 v36.83,20.32 | v58.67,25.4 65.28,25.4
MOSI  (via drill 0.41)
  Top 0.254: MOUTH.12 73.41,34.8 73.41,36.83 65.79,36.83 62.99,34.04 62.99,33.02 62.74,32.77 HIPS.2 62.48,32.51 v62.48,30.23 | v16.51,19.3 16.51,17.53 ARMS.2 | BRAINS.21 35.05,23.11 35.05,22.35 35.81,21.59 35.81,19.56 v36.07,19.3 v38.61,19.3
  Bottom 0.254: v36.07,19.3 v16.51,19.3 | v62.48,30.23 57.4,30.23 56.64,29.46 56.64,25.4 57.15,24.89 57.15,23.62 53.09,23.62 51.56,22.1 41.4,22.1 v38.61,19.3
N$1  (via drill 0.41)
  Top 0.508: v56.39,46.74 56.39,45.47 55.63,44.7 55.63,39.62 55.37,39.37 LEGS1.21
  Bottom 0.508: v56.39,46.74 57.66,48.01 60.71,48.01 61.21,48.51 61.21,50.04 54.61,50.04 53.34,51.31 53.34,53.34 M1.2
N$2  (via drill 0.41)
  Top 0.508: v59.18,51.05 59.18,49.02 LEGS1.1 | v54.61,51.56 54.1,51.05 51.31,51.05 51.31,53.09 50.8,53.59 M1.1
  Bottom 0.508: v59.18,51.05 55.12,51.05 v54.61,51.56
N$3
  Top 0.254: M1_LPF.3 32.77,48.26 33.27,48.77 33.27,49.28 33.53,49.53 36.07,49.53 36.07,48.26 37.59,46.74 M1_CA.1
  Top 0.508: M1_RA.1 M1_CA.1
N$4
  Top 0.508: LEGS1.5 54.1,49.02 54.36,49.28 54.36,50.04 54.86,50.55 55.88,50.55 55.88,53.59 M1.3
N$5
  Top 0.508: LEGS1.2 57.91,49.02 58.17,49.28 58.17,53.09 58.42,53.34 M1.4
N$6
  Top 0.508: M2.2 53.34,2.79 54.86,4.32 54.86,6.6 55.12,6.86 LEGS2.21
N$7  (via drill 0.41)
  Top 0.254: v40.13,40.39 40.13,42.16 M1_R1A.2 | v36.07,40.39 36.07,45.21 34.04,47.24 34.04,48.01 M1_LPF.2
  Bottom 0.254: v36.07,40.39 v40.13,40.39
N$8  (via drill 0.41)
  Top 0.508: v60.2,15.24 59.18,16.26 LEGS2.1 | v60.96,5.59 v60.96,3.56
  Bottom 0.508: v60.2,15.24 60.45,14.99 72.9,14.99 78.49,9.4 78.49,3.56 v60.96,3.56 | v60.96,5.59 45.97,5.59 45.47,5.08 45.47,2.54 M2.1
N$9
  Top 0.508: M2.3 55.88,4.57 58.93,4.57 59.94,5.59 59.94,7.11 61.21,8.38 61.21,18.03 54.61,18.03 54.36,17.78 54.36,16.76 54.1,16.51 LEGS2.5
N$10  (via drill 0.41)
  Top 0.508: v59.94,8.89 59.94,12.95 58.17,14.73 58.17,16 57.91,16.26 LEGS2.2 | v62.23,5.59 61.98,5.33 61.98,3.05 61.21,2.29 M2.4
  Bottom 0.508: v59.94,8.89 60.2,8.64 71.63,8.64 71.88,8.89 72.9,8.89 73.66,8.13 73.66,5.59 v62.23,5.59
N$11
  Top 0.508: ANT.1 81.92,36.51 81.6,36.2 81.6,34.92 MOUTH.8
N$12
  Top 0.254: M2_LPF.3 32.77,11.68 33.27,11.18 33.27,10.67 33.53,10.41 37.59,10.41 M2_RA.1
  Top 0.508: M2_CA.1 M2_RA.1
N$13  (via drill 0.41)
  Top 0.508: v72.39,7.87 72.39,8.64 74.17,8.64 21RC.1 | v57.91,8.64 57.91,7.11 LEGS2.23 | v61.98,7.62 61.98,7.87 64.26,7.87 21RS.2
  Bottom 0.508: 61.98,7.87 58.67,7.87 v57.91,8.64 | 61.98,7.87 v72.39,7.87 | 61.98,7.87 v61.98,7.62
N$14  (via drill 0.41)
  Top 0.254: v56.64,8.64 56.64,7.11 LEGS2.22 | v72.64,6.6 74.17,6.6 74.17,6.86 21RC.2
  Top 0.508: 21CC.1 21RC.2
  Bottom 0.254: v56.64,8.64 58.67,6.6 v72.64,6.6
N$15  (via drill 0.41)
  Top 0.254: v45.21,18.29 45.21,16.51 LEGS2.12 | v79.25,16.76 79.25,13.97 22CT.1
  Top 0.508: 22RT.2 22CT.1
  Bottom 0.254: v45.21,18.29 46.23,17.27 78.74,17.27 v79.25,16.76
N$16  (via drill 0.41)
  Top 0.508: v72.64,11.68 72.64,11.94 74.17,11.94 22RC.2 | v69.6,9.65 69.6,8.13 22RS.2 | v56.64,9.91 56.64,16.26 LEGS2.3
  Bottom 0.508: v72.64,11.68 70.61,9.65 v69.6,9.65 69.34,9.91 v56.64,9.91
N$17  (via drill 0.41)
  Top 0.254: v55.37,14.48 55.37,16.26 LEGS2.4 | v72.39,13.97 74.17,13.97 22RC.1
  Top 0.508: 22CC.1 22RC.1
  Bottom 0.254: v55.37,14.48 55.63,14.22 72.14,14.22 v72.39,13.97
N$18  (via drill 0.41)
  Top 0.254: v46.48,4.57 46.48,6.86 LEGS2.14 | v77.47,4.57 79.25,6.35 79.25,6.86 21CT.1
  Top 0.508: 21RT.2 21CT.1
  Bottom 0.254: v77.47,4.57 v46.48,4.57
N$19
  Top 0.254: M2_R1A.2 40.13,12.45 39.62,12.95 39.62,13.46 37.59,15.49 34.04,15.49 34.04,11.94 M2_LPF.2
N$20
  Top 0.508: R16.2 R15.1 | R16.2 | R16.2 14.61,36.2 13.34,35.24 13.34,34.29 13.34,33.97 12.7,33.97 3V3.1
N$21  (via drill 0.41)
  Top 0.254: v26.42,39.88 26.42,42.16 M1_R1B.2 | v32.51,40.64 32.51,43.18 M1_LPF.6
  Bottom 0.254: v26.42,39.88 31.75,39.88 v32.51,40.64
N$22
  Top 0.508: M1_RB.1 M1_CB.1 | M1_RB.1 | M1_RB.1 31.11,44.13 31.43,43.81 31.43,43.5 M1_LPF.5
N$23  (via drill 0.41)
  Top 0.254: v24.64,6.1 24.64,11.68 25.65,11.68 26.16,12.19 M2_R1B.2 | v32.51,5.33 32.51,7.11 M2_LPF.6
  Bottom 0.254: v24.64,6.1 24.89,6.35 31.5,6.35 v32.51,5.33
N$24
  Top 0.508: M2_CB.1 M2_RB.1 | M2_CB.1 | M2_CB.1 31.11,7.94 31.43,7.62 31.43,7.3 M2_LPF.5
N$25
  Top 1.27: 4.45,24.77 5.71,24.77
N$26
  Top 0.254: T1.C 23.37,48.26 23.62,48.51 23.62,48.77 27.18,52.32 30.99,52.32 30.99,54.1 AIO.2
N$27
  Top 0.508: R14.2 R13.1 | R14.2 | R14.2 5.4,45.72 3.49,45.72 3.17,45.4 3.17,44.13 2.86,44.13 5V.1
N$28
  Top 0.254: T1.B 22.1,45.97 20.32,47.75 19.81,47.75 R1.1
N$31  (via drill 0.41)
  Top 0.508: v72.64,42.93 72.64,43.18 73.66,43.18 74.17,43.69 11RC.2 | LEGS1.23 57.91,39.37 v57.91,41.4 57.91,44.45 60.96,44.45 64.26,47.75 11RS.2
  Bottom 0.508: v72.64,42.93 71.12,41.4 v57.91,41.4
N$33  (via drill 0.41)
  Top 0.254: v56.64,42.16 56.64,39.37 LEGS1.22 | v71.12,42.93 72.14,41.91 74.17,41.91 11RC.1
  Top 0.508: 11CC.1 11RC.1
  Bottom 0.254: v56.64,42.16 56.9,42.42 70.61,42.42 v71.12,42.93
N$34  (via drill 0.41)
  Top 0.254: v55.37,45.97 55.37,48.77 LEGS1.4 | v72.64,48.77 74.17,48.77 12RC.2
  Top 0.508: 12CC.1 12RC.2
  Bottom 0.254: v55.37,45.97 55.63,45.72 69.6,45.72 v72.64,48.77
N$35
  Top 0.508: 71.63,47.94 72.07,47.94 73.03,46.99 12RC.1 | 71.63,47.94 69.53,47.94 12RS.2 | LEGS1.3 56.64,48.77 56.9,48.51 56.9,47.75 57.4,47.24 62.23,47.24 62.23,54.61 62.74,55.12 71.88,55.12 71.88,49.53 71.63,49.28 71.63,48.01 71.63,47.94
N$40
  Top 0.508: BRAINS.20 33.66,22.86 33.66,20.64 34.29,20 C1.1
N$41  (via drill 0.41)
  Top 0.254: v46.48,36.58 46.48,39.12 LEGS1.14 | v55.12,36.58 56.13,37.59 v56.64,37.59 | v80.01,38.86 80.01,41.91 11CT.1
  Top 0.508: 11RT.2 80.01,41.91 11CT.1
  Bottom 0.254: v55.12,36.58 v46.48,36.58 | v56.64,37.59 57.91,38.86 v80.01,38.86
N$42  (via drill 0.41)
  Top 0.254: v46.99,40.89 46.48,40.89 45.47,41.91 45.47,48.51 45.21,48.77 LEGS1.12 | v82.8,40.39 83.06,40.64 83.06,48.01 82.04,49.02 12RT.2
  Top 0.508: 12RT.2 12CT.1
  Bottom 0.254: v46.99,40.89 48.01,41.91 51.05,41.91 52.32,40.64 57.4,40.64 57.66,40.39 v82.8,40.39
N$46
  Top 0.508: RL1.1 37.47,52.39 HB.C
N$65
  Top 0.508: PWR.C 2.54,34.61 4.13,34.61 RL2.1
PGC  (via drill 0.41)
  Top 0.254: v38.86,29.21 38.86,32.51 BRAINS.5 | v50.04,18.54 v50.04,23.11 | v42.93,4.32 v42.93,17.27
  Bottom 0.254: v38.86,29.21 40.39,27.69 40.39,23.11 v50.04,23.11 | v50.04,18.54 46.23,18.54 45.47,19.3 44.96,19.3 v42.93,17.27 | v42.93,4.32 5.33,4.32 ICD.5
PGD  (via drill 0.41)
  Top 0.254: v39.88,30.99 39.88,32.51 BRAINS.4 | v24.13,25.4 23.88,25.15 23.88,10.16 v21.84,8.13
  Bottom 0.254: v39.88,30.99 38.86,32 24.89,32 24.38,31.5 22.86,31.5 21.34,29.97 21.34,26.92 22.61,26.92 v24.13,25.4 | v21.84,8.13 20.07,9.91 2.03,9.91 ICD.4
RFM_CS  (via drill 0.41)
  Top 0.254: v33.78,35.56 33.78,32.77 BRAINS.9 | v55.88,35.56 56.39,35.56 v57.66,36.83 | v68.07,35.81 69.34,34.54 MOUTH.14
  Bottom 0.254: v55.88,35.56 v33.78,35.56 | v57.66,36.83 67.06,36.83 v68.07,35.81
RFM_IRQ  (via drill 0.41)
  Top 0.254: v41.4,34.29 41.4,32.77 BRAINS.3 | v67.06,29.72 71.37,25.4 71.37,18.8 MOUTH.2
  Bottom 0.254: v41.4,34.29 42.93,32.77 64.01,32.77 v67.06,29.72
SCLK  (via drill 0.41)
  Top 0.254: v63.75,29.72 63.75,32.51 HIPS.1 | v65.79,29.72 69.34,33.27 71.37,33.27 71.37,34.54 MOUTH.13 | v17.78,16 17.78,17.27 ARMS.1 | v25.15,16 25.15,23.11 26.67,24.64 | 26.67,24.64 30.99,24.64 30.99,23.37 BRAINS.18 | 26.67,24.64 v26.67,24.89
  Bottom 0.254: v65.79,29.72 v63.75,29.72 63.75,32.26 41.66,32.26 39.37,34.54 33.27,34.54 32.51,35.31 24.89,35.31 23.88,34.29 22.86,34.29 21.08,32.51 21.08,31.24 20.32,30.48 20.32,25.65 20.57,25.65 21.84,24.38 26.16,24.38 v26.67,24.89 | v25.15,16 v17.78,16

### Text on the board
tPlace: -- | - | +
tNames: 5V | 3V3 | GND | 0 | 1 | 2 | 3 | 4 | 5 | 6 | 7 | 1A | 1B | 2B | 2A | 12 | 11 | RT | RC | CC | CT | RT | R2 | CB | CA | R2 | R1 | RB | RA | R1 | + | + | R1 | RB | RA | R1 | RC | CC | CT | RT | R2 | CB | CA | R2 | 22 | 21 | 0 | 1 | 2 | 3 | 4 | 5 | 6 | 7 | 1A | 1B | 2B | 2A | 3V3 | GND
_tsilk: MCLR | 3V3 | GND | PGD | PGC